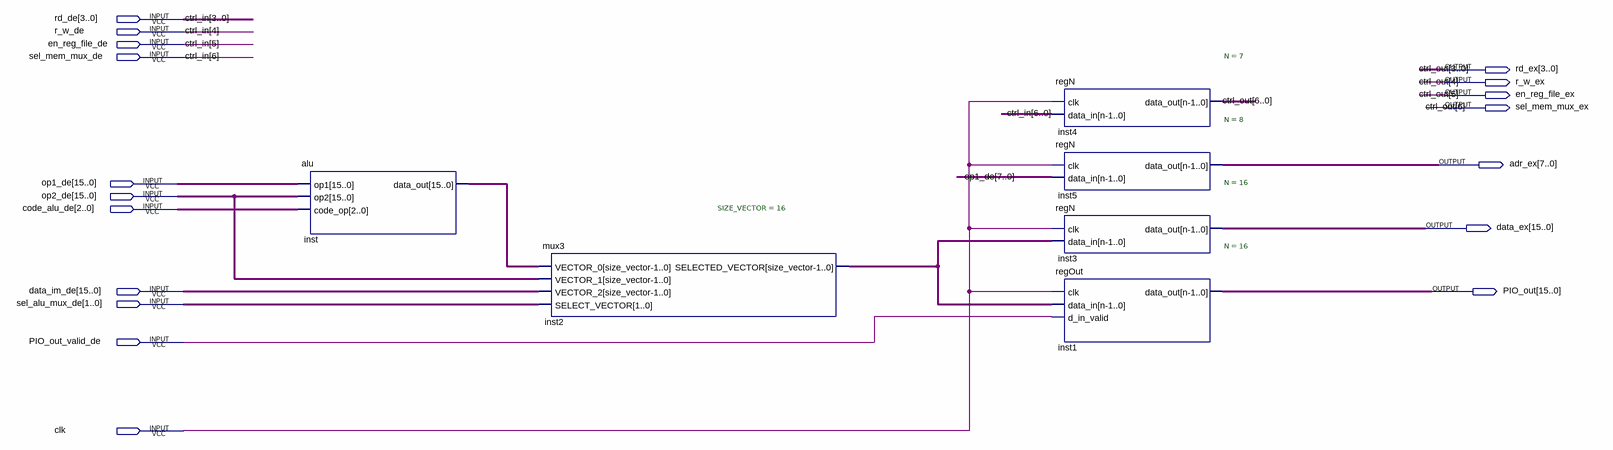
[diagram p0: schematic sheet]
// Quartus schematic Etage_EX.bdf as structural Verilog: 6 symbols, 18 pins
module Etage_EX (
  input  [3:0] rd_de,
  input  r_w_de,
  input  en_reg_file_de,
  input  sel_mem_mux_de,
  input  [15:0] op1_de,
  input  [15:0] op2_de,
  input  [2:0] code_alu_de,
  input  [15:0] data_im_de,
  input  [1:0] sel_alu_mux_de,
  input  PIO_out_valid_de,
  input  clk,
  output [3:0] rd_ex,
  output r_w_ex,
  output en_reg_file_ex,
  output sel_mem_mux_ex,
  output [7:0] adr_ex,
  output [15:0] data_ex,
  output [15:0] PIO_out
);

  wire [15:0] inst2_selected_vector, inst_data_out;

  alu inst (.op1(op1_de), .op2(op2_de), .code_op(code_alu_de), .data_out(inst_data_out));
  mux3 #(.SIZE_VECTOR(16)) inst2 (
    .VECTOR_0(inst_data_out), .VECTOR_1(op2_de), .VECTOR_2(data_im_de), .SELECT_VECTOR(sel_alu_mux_de),
    .SELECTED_VECTOR(inst2_selected_vector));
  regN #(.N(7)) inst4 (
    .clk(clk), .data_in({sel_mem_mux_de, en_reg_file_de, r_w_de, rd_de}),
    .data_out({sel_mem_mux_ex, en_reg_file_ex, r_w_ex, rd_ex}));
  regN #(.N(8)) inst5 (.clk(clk), .data_in(op1_de[7:0]), .data_out(adr_ex));
  regN #(.N(16)) inst3 (.clk(clk), .data_in(inst2_selected_vector), .data_out(data_ex));
  regOut #(.N(16)) inst1 (
    .clk(clk), .data_in(inst2_selected_vector), .d_in_valid(PIO_out_valid_de), .data_out(PIO_out));

  // Other names for the same wires on the sheet: ctrl_in[6:0] = {sel_mem_mux_de, en_reg_file_de, r_w_de, rd_de};
  //   ctrl_out[6:0] = {sel_mem_mux_ex, en_reg_file_ex, r_w_ex, rd_ex}
endmodule
